# Altium schematic sheet EMG_CHANNEL_1_ANALOG.SchDoc
size 594 x 420 mm
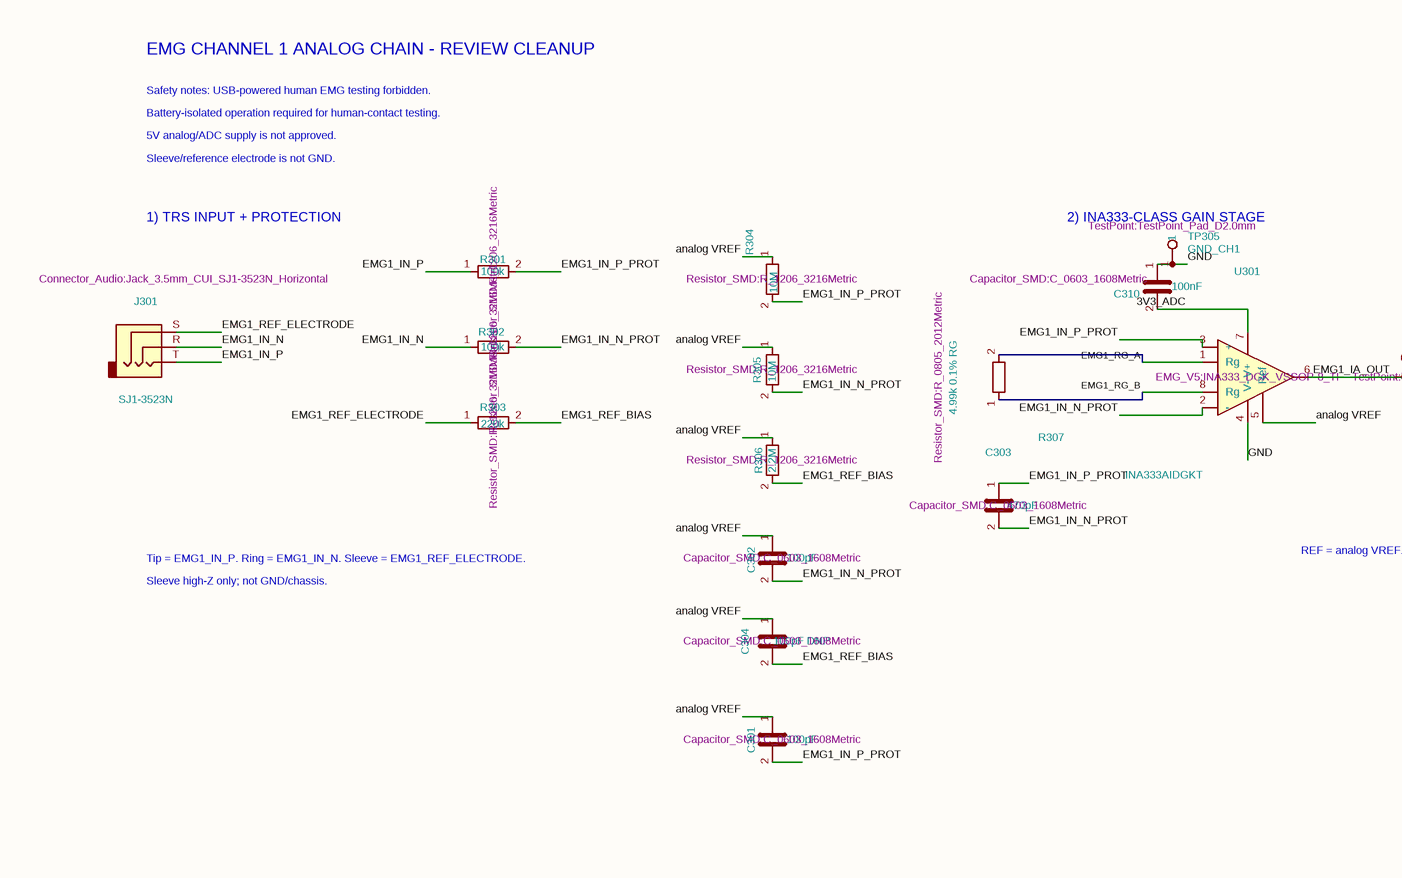
[diagram p0: EMG_CHANNEL_1_ANALOG.SchDoc, left]
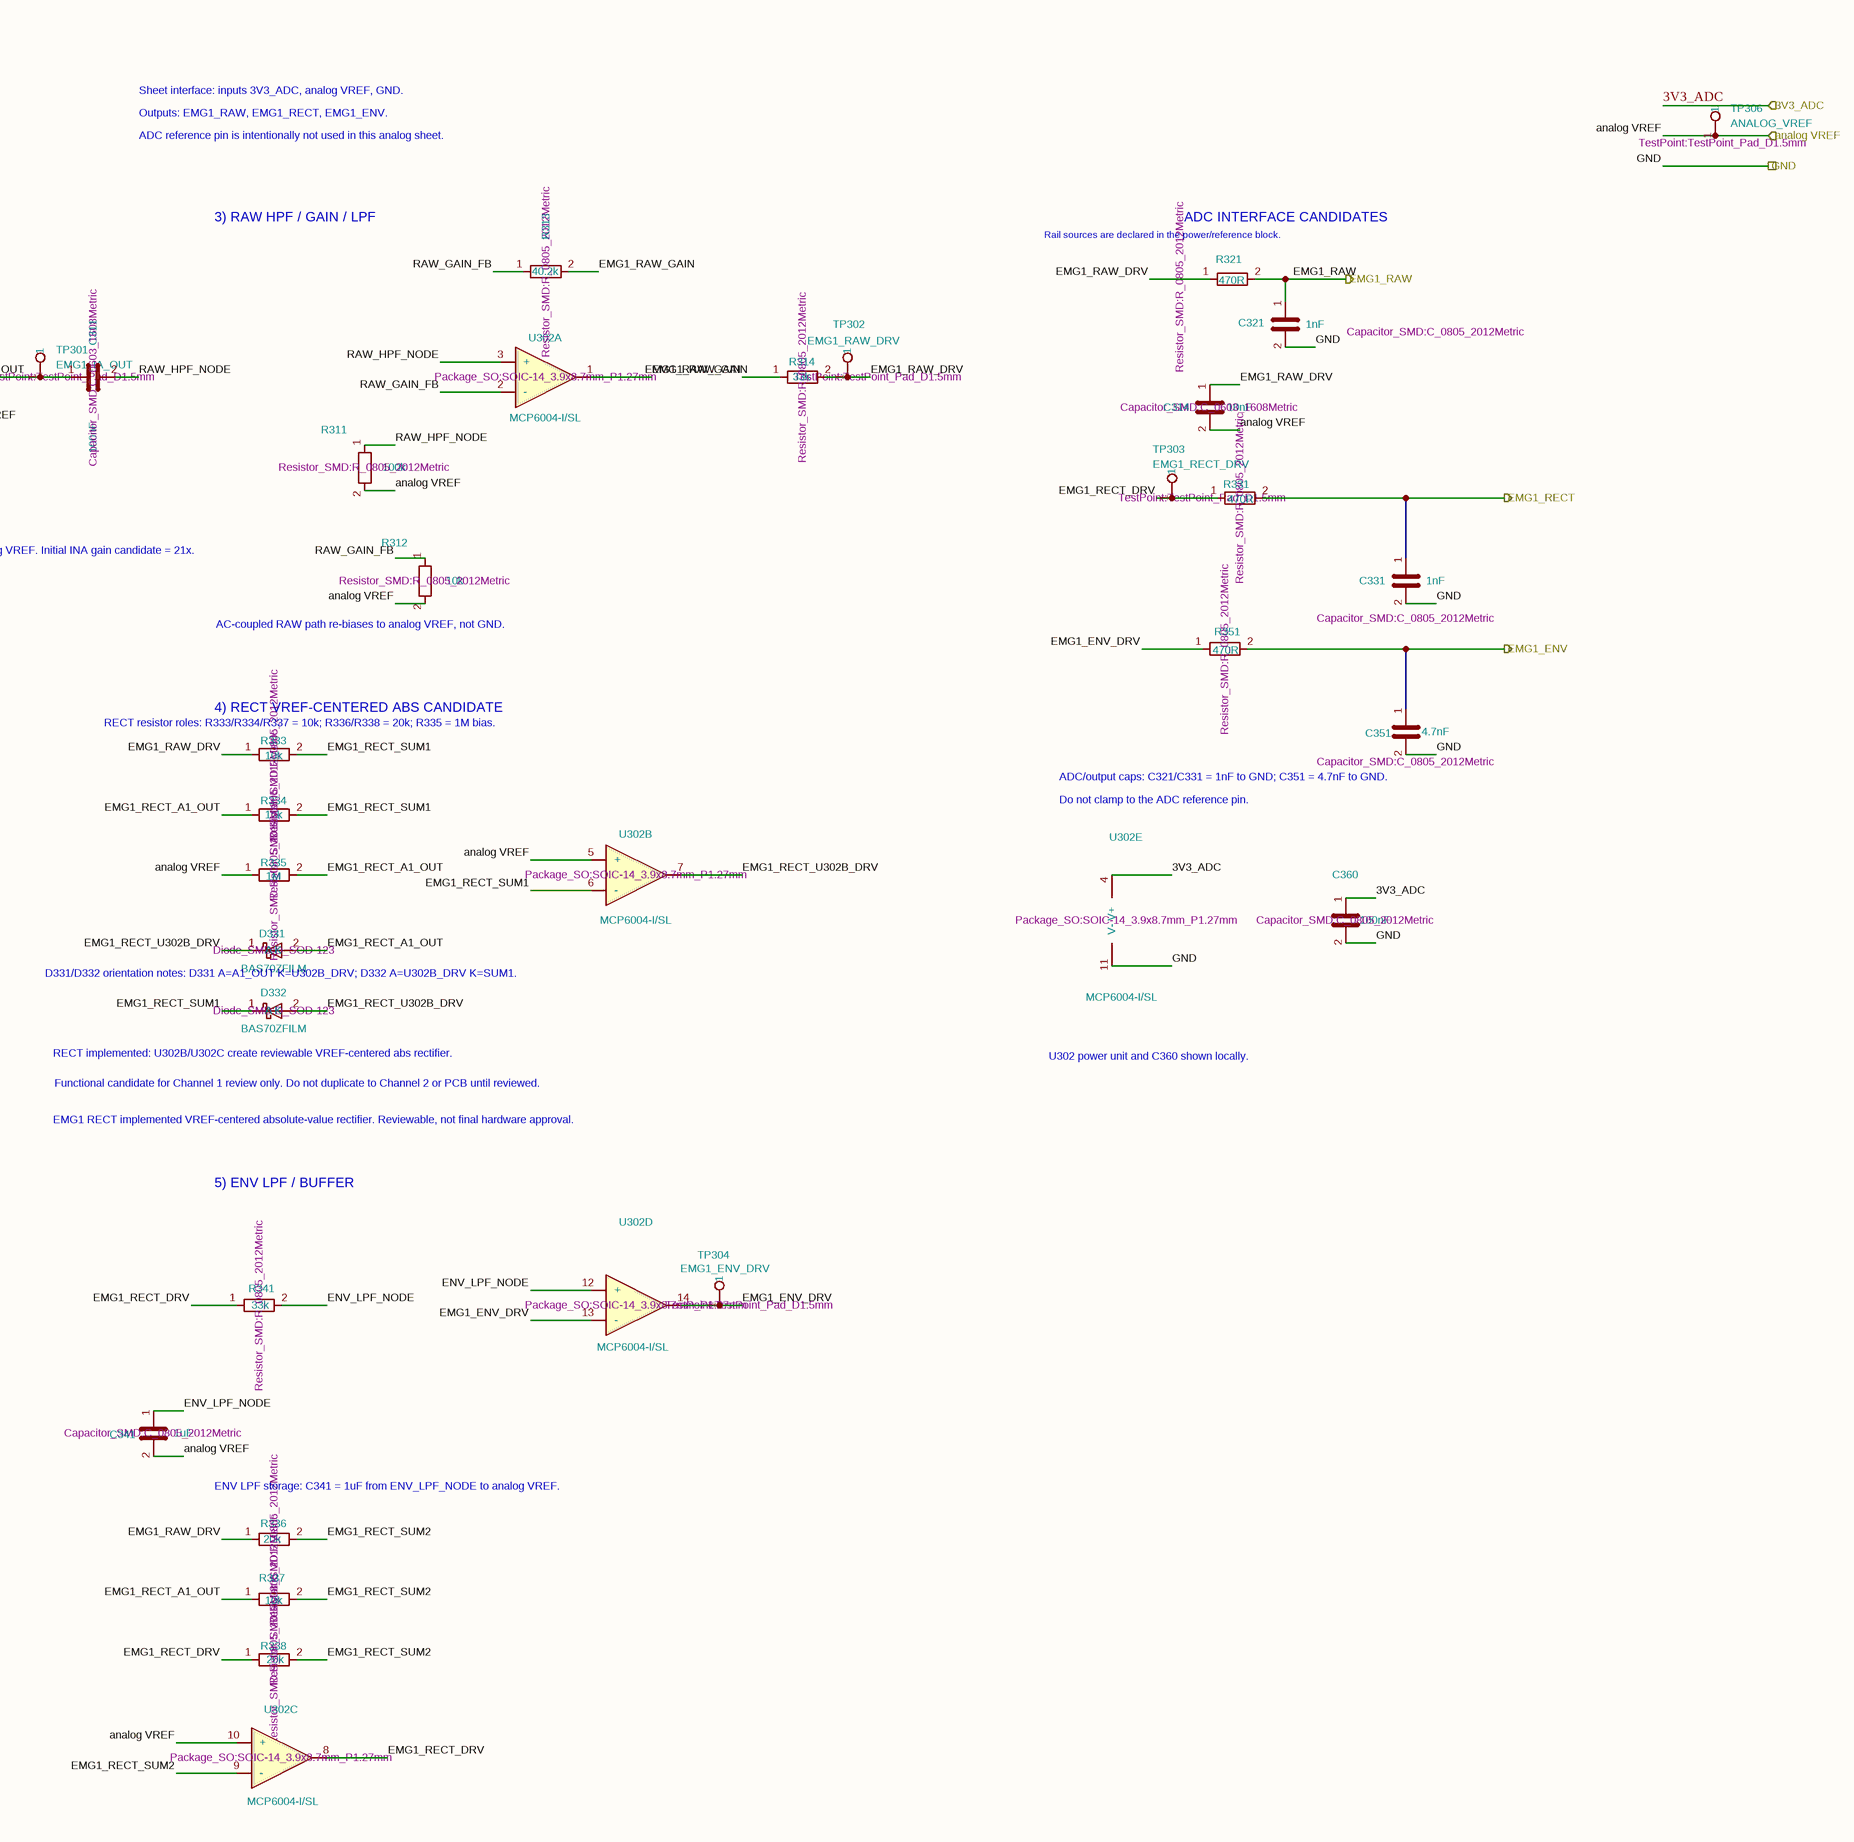
[diagram p1: EMG_CHANNEL_1_ANALOG.SchDoc, right]

## Parts
C301  Footprint: Capacitor_SMD:C_0603_1608Metric  [C_0603_1608Metric]  (hidden comment: 100pF)
C302  Footprint: Capacitor_SMD:C_0603_1608Metric  [C_0603_1608Metric]  (hidden comment: 100pF)
C303  Footprint: Capacitor_SMD:C_0603_1608Metric  [C_0603_1608Metric]  (hidden comment: 470pF)
C304  Footprint: Capacitor_SMD:C_0603_1608Metric  [C_0603_1608Metric]  (hidden comment: 100pF DNP)
C310  Footprint: Capacitor_SMD:C_0603_1608Metric  [C_0603_1608Metric]  (hidden comment: 100nF)
C311  Footprint: Capacitor_SMD:C_0603_1608Metric  [C_0603_1608Metric]  (hidden comment: 100nF)
C314  Footprint: Capacitor_SMD:C_0603_1608Metric  [C_0603_1608Metric]  (hidden comment: 10nF)
C321  Footprint: Capacitor_SMD:C_0805_2012Metric  [C_0805_2012Metric]  (hidden comment: 1nF)
C331  Footprint: Capacitor_SMD:C_0805_2012Metric  [C_0805_2012Metric]  (hidden comment: 1nF)
C341  Footprint: Capacitor_SMD:C_0805_2012Metric  [C_0805_2012Metric]  (hidden comment: 1uF)
C351  Footprint: Capacitor_SMD:C_0805_2012Metric  [C_0805_2012Metric]  (hidden comment: 4.7nF)
C360  Footprint: Capacitor_SMD:C_0805_2012Metric  [C_0805_2012Metric]  (hidden comment: 100nF)
D331  Footprint: Diode_SMD:D_SOD-123  [D_SOD-123]  (hidden comment: BAS70ZFILM)
D332  Footprint: Diode_SMD:D_SOD-123  [D_SOD-123]  (hidden comment: BAS70ZFILM)
J301  Footprint: Connector_Audio:Jack_3.5mm_CUI_SJ1-3523N_Horizontal  [Jack_3.5mm_CUI_SJ1-3523N_Horizontal]  (hidden comment: SJ1-3523N)
R301  Footprint: Resistor_SMD:R_1206_3216Metric  [R_1206_3216Metric]  (hidden comment: 100k)
R302  Footprint: Resistor_SMD:R_1206_3216Metric  [R_1206_3216Metric]  (hidden comment: 100k)
R303  Footprint: Resistor_SMD:R_1206_3216Metric  [R_1206_3216Metric]  (hidden comment: 220k)
R304  Footprint: Resistor_SMD:R_1206_3216Metric  [R_1206_3216Metric]  (hidden comment: 10M)
R305  Footprint: Resistor_SMD:R_1206_3216Metric  [R_1206_3216Metric]  (hidden comment: 10M)
R306  Footprint: Resistor_SMD:R_1206_3216Metric  [R_1206_3216Metric]  (hidden comment: 2.2M)
R307  Footprint: Resistor_SMD:R_0805_2012Metric  [R_0805_2012Metric]  (hidden comment: 4.99k 0.1% RG)
R311  Footprint: Resistor_SMD:R_0805_2012Metric  [R_0805_2012Metric]  (hidden comment: 100k)
R312  Footprint: Resistor_SMD:R_0805_2012Metric  [R_0805_2012Metric]  (hidden comment: 10k)
R313  Footprint: Resistor_SMD:R_0805_2012Metric  [R_0805_2012Metric]  (hidden comment: 40.2k)
R314  Footprint: Resistor_SMD:R_0805_2012Metric  [R_0805_2012Metric]  (hidden comment: 33k)
R321  Footprint: Resistor_SMD:R_0805_2012Metric  [R_0805_2012Metric]  (hidden comment: 470R)
R331  Footprint: Resistor_SMD:R_0805_2012Metric  [R_0805_2012Metric]  (hidden comment: 470R)
R333  Footprint: Resistor_SMD:R_0805_2012Metric  [R_0805_2012Metric]  (hidden comment: 10k)
R334  Footprint: Resistor_SMD:R_0805_2012Metric  [R_0805_2012Metric]  (hidden comment: 10k)
R335  Footprint: Resistor_SMD:R_0805_2012Metric  [R_0805_2012Metric]  (hidden comment: 1M)
R336  Footprint: Resistor_SMD:R_0805_2012Metric  [R_0805_2012Metric]  (hidden comment: 20k)
R337  Footprint: Resistor_SMD:R_0805_2012Metric  [R_0805_2012Metric]  (hidden comment: 10k)
R338  Footprint: Resistor_SMD:R_0805_2012Metric  [R_0805_2012Metric]  (hidden comment: 20k)
R341  Footprint: Resistor_SMD:R_0805_2012Metric  [R_0805_2012Metric]  (hidden comment: 33k)
R351  Footprint: Resistor_SMD:R_0805_2012Metric  [R_0805_2012Metric]  (hidden comment: 470R)
TP301  Footprint: TestPoint:TestPoint_Pad_D1.5mm  [TestPoint_Pad_D1.5mm]  (hidden comment: EMG1_IA_OUT)
TP302  Footprint: TestPoint:TestPoint_Pad_D1.5mm  [TestPoint_Pad_D1.5mm]  (hidden comment: EMG1_RAW_DRV)
TP303  Footprint: TestPoint:TestPoint_Pad_D1.5mm  [TestPoint_Pad_D1.5mm]  (hidden comment: EMG1_RECT_DRV)
TP304  Footprint: TestPoint:TestPoint_Pad_D1.5mm  [TestPoint_Pad_D1.5mm]  (hidden comment: EMG1_ENV_DRV)
TP305  Footprint: TestPoint:TestPoint_Pad_D2.0mm  [TestPoint_Pad_D2.0mm]  (hidden comment: GND_CH1)
TP306  Footprint: TestPoint:TestPoint_Pad_D1.5mm  [TestPoint_Pad_D1.5mm]  (hidden comment: ANALOG_VREF)
U301  Footprint: EMG_V5:INA333_DGK_VSSOP-8_TI  [INA333_DGK_VSSOP-8_TI]  (hidden comment: INA333AIDGKT)
U302  Footprint: Package_SO:SOIC-14_3.9x8.7mm_P1.27mm  [SOIC-14_3.9x8.7mm_P1.27mm]  (hidden comment: MCP6004-I/SL)  (parts A,B,C,D,E of 5)

## Ports
3V3_ADC (in), analog VREF (in), EMG1_ENV (out), EMG1_RAW (out), EMG1_RECT (out), GND

## Nets
3V3_ADC: C310.2 C360.1 U301.7(V+) U302.4(V+) ; port 3V3_ADC
analog VREF: C301.1 C302.1 C304.1 C314.2 C341.2 R304.1 R305.1 R306.1 R311.2 R312.2 R335.1 TP306.1 U301.5(Ref) U302.5(+) U302.10(+) ; port analog VREF
EMG1_ENV: C351.1 R351.2 ; port EMG1_ENV
EMG1_ENV_DRV: R351.1 TP304.1 U302.13(-) U302.14
EMG1_IA_OUT: C311.1 TP301.1 U301.6
EMG1_IN_N: J301.R R302.1
EMG1_IN_N_PROT: C302.2 C303.2 R302.2 R305.2 U301.2(-)
EMG1_IN_P: J301.T R301.1
EMG1_IN_P_PROT: C301.2 C303.1 R301.2 R304.2 U301.3(+)
EMG1_RAW: C321.1 R321.2 ; port EMG1_RAW
EMG1_RAW_DRV: C314.1 R314.2 R321.1 R333.1 R336.1 TP302.1
EMG1_RAW_GAIN: R313.2 R314.1 U302.1
EMG1_RECT: C331.1 R331.2 ; port EMG1_RECT
EMG1_RECT_A1_OUT: D331.2(A) R334.1 R335.2 R337.1
EMG1_RECT_DRV: R331.1 R338.1 R341.1 TP303.1 U302.8
EMG1_RECT_SUM1: D332.1(K) R333.2 R334.2 U302.6(-)
EMG1_RECT_SUM2: R336.2 R337.2 R338.2 U302.9(-)
EMG1_RECT_U302B_DRV: D331.1(K) D332.2(A) U302.7
EMG1_REF_BIAS: C304.2 R303.2 R306.2
EMG1_REF_ELECTRODE: J301.S R303.1
EMG1_RG_A: R307.2 U301.1(Rg)
EMG1_RG_B: R307.1 U301.8(Rg)
ENV_LPF_NODE: C341.1 R341.2 U302.12(+)
GND: C310.1 C321.2 C331.2 C351.2 C360.2 TP305.1 U301.4(V-) U302.11(V-) ; port GND
RAW_GAIN_FB: R312.1 R313.1 U302.2(-)
RAW_HPF_NODE: C311.2 R311.1 U302.3(+)

## Notes on the sheet
- EMG CHANNEL 1 ANALOG CHAIN - REVIEW CLEANUP
- Safety notes: USB-powered human EMG testing forbidden.
- Battery-isolated operation required for human-contact testing.
- Sheet interface: inputs 3V3_ADC, analog VREF, GND.
- Outputs: EMG1_RAW, EMG1_RECT, EMG1_ENV.
- 5V analog/ADC supply is not approved.
- Sleeve/reference electrode is not GND.
- ADC reference pin is intentionally not used in this analog sheet.
- 1) TRS INPUT + PROTECTION
- (near TP305) 2) INA333-CLASS GAIN STAGE
- 3) RAW HPF / GAIN / LPF
- (near R321) Rail sources are declared in the power/reference block.
- (near R321) ADC INTERFACE CANDIDATES
- Tip = EMG1_IN_P. Ring = EMG1_IN_N. Sleeve = EMG1_REF_ELECTRODE.
- REF = analog VREF. Initial INA gain candidate = 21x.
- Sleeve high-Z only; not GND/chassis.
- (near R312) AC-coupled RAW path re-biases to analog VREF, not GND.
- (near R333) RECT resistor roles: R333/R334/R337 = 10k; R336/R338 = 20k; R335 = 1M bias.
- (near R333) 4) RECT VREF-CENTERED ABS CANDIDATE
- (near C351) ADC/output caps: C321/C331 = 1nF to GND; C351 = 4.7nF to GND.
- Do not clamp to the ADC reference pin.
- D331/D332 orientation notes: D331 A=A1_OUT K=U302B_DRV; D332 A=U302B_DRV K=SUM1.
- (near D332) RECT implemented: U302B/U302C create reviewable VREF-centered abs rectifier.
- Functional candidate for Channel 1 review only. Do not duplicate to Channel 2 or PCB until reviewed.
- U302 power unit and C360 shown locally.
- EMG1 RECT implemented VREF-centered absolute-value rectifier. Reviewable, not final hardware approval.
- 5) ENV LPF / BUFFER
- (near R336) ENV LPF storage: C341 = 1uF from ENV_LPF_NODE to analog VREF.
- 1
- 2
- 3
- 4
- 5
- 6
- 7
- 8
- 9
- 10
- 11
- A
- B
- C
- D
- E
- F
- G
- H
- Title:
- File: EMG_CHANNEL_1_ANALOG.kicad_sch
- Sheet: /
- KiCad E.D.A.  kicad (5.1.4)-1
- Size: A2
- Date:
- Rev:
- Id: 1/1

## Library data of the parts
C301-C304 C310 C311 C314 C321 C331 C341 C351 C360 = C
  C301 C302: Value: 100pF
  C303: Value: 470pF
  C304: Value: 100pF DNP
  C310 C311 C360: Value: 100nF
  C314: Value: 10nF
  C321 C331: Value: 1nF
  C341: Value: 1uF
  C351: Value: 4.7nF
D331 D332 = D_Schottky: Value: BAS70ZFILM
J301 = AudioJack3: Value: SJ1-3523N
R301-R307 R311-R314 R321 R331 R333-R338 R341 R351 = R
  R301 R302 R311: Value: 100k
  R303: Value: 220k
  R304 R305: Value: 10M
  R306: Value: 2.2M
  R307: Value: 4.99k 0.1% RG
  R312 R333 R334 R337: Value: 10k
  R313: Value: 40.2k
  R314 R341: Value: 33k
  R321 R331 R351: Value: 470R
  R335: Value: 1M
  R336 R338: Value: 20k
TP301-TP306 = TestPoint
  TP301: Value: EMG1_IA_OUT
  TP302: Value: EMG1_RAW_DRV
  TP303: Value: EMG1_RECT_DRV
  TP304: Value: EMG1_ENV_DRV
  TP305: Value: GND_CH1
  TP306: Value: ANALOG_VREF
U301 = INA333xxDGK: Value: INA333AIDGKT
U302 = MCP6004: Value: MCP6004-I/SL